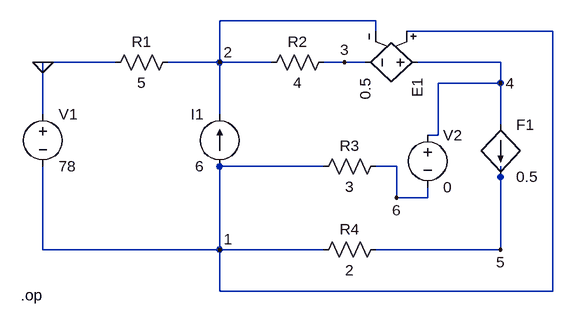
[diagram p0: schematic ex2.asc]
ex2.asc, the LTspice schematic file:
Version 4
SHEET 1 880 680
WIRE 368 16 128 16
WIRE 368 32 368 16
WIRE 640 32 416 32
WIRE -32 80 -144 80
WIRE 128 80 128 16
WIRE 128 80 48 80
WIRE 208 80 128 80
WIRE 320 80 288 80
WIRE 352 80 320 80
WIRE 560 80 432 80
WIRE 560 112 560 80
WIRE 560 112 464 112
WIRE -144 160 -144 80
WIRE 128 160 128 80
WIRE 560 176 560 112
WIRE 464 192 464 112
WIRE 464 192 448 192
WIRE 288 240 128 240
WIRE 400 240 368 240
WIRE 560 256 560 240
WIRE 400 288 400 240
WIRE 448 288 448 272
WIRE 448 288 400 288
WIRE -144 368 -144 240
WIRE 128 368 128 240
WIRE 128 368 -144 368
WIRE 288 368 128 368
WIRE 560 368 560 256
WIRE 560 368 368 368
WIRE 128 432 128 368
WIRE 640 432 640 32
WIRE 640 432 128 432
FLAG 128 368 1
FLAG -144 80 0
FLAG 128 80 2
FLAG 320 80 3
FLAG 560 112 4
FLAG 560 368 5
FLAG 400 288 6
SYMBOL res 64 64 R90
WINDOW 0 0 56 VBottom 2
WINDOW 3 32 56 VTop 2
SYMATTR InstName R1
SYMATTR Value 5
SYMBOL res 304 64 R90
WINDOW 0 0 56 VBottom 2
WINDOW 3 32 56 VTop 2
SYMATTR InstName R2
SYMATTR Value 4
SYMBOL res 384 224 R90
WINDOW 0 0 56 VBottom 2
WINDOW 3 32 56 VTop 2
SYMATTR InstName R3
SYMATTR Value 3
SYMBOL res 384 352 R90
WINDOW 0 0 56 VBottom 2
WINDOW 3 32 56 VTop 2
SYMATTR InstName R4
SYMATTR Value 2
SYMBOL voltage -144 144 R0
WINDOW 123 0 0 Left 0
WINDOW 39 0 0 Left 0
SYMATTR InstName V1
SYMATTR Value 78
SYMBOL current 128 240 R180
WINDOW 0 24 80 Left 2
WINDOW 3 24 0 Left 2
WINDOW 123 0 0 Left 0
WINDOW 39 0 0 Left 0
SYMATTR InstName I1
SYMATTR Value 6
SYMBOL e 448 80 R90
SYMATTR InstName E1
SYMATTR Value 0.5
SYMBOL voltage 448 176 R0
WINDOW 123 0 0 Left 0
WINDOW 39 0 0 Left 0
SYMATTR InstName V2
SYMATTR Value 0
SYMBOL f 560 176 R0
SYMATTR InstName F1
SYMATTR Value 0.5
SYMATTR SpiceModel v2
TEXT -178 438 Left 2 !.op

The netlist it stands for:
* ex2.asc
R1 2 0 5
R2 3 2 4
R3 6 1 3
R4 5 1 2
V1 0 1 78
I1 1 2 6
E1 4 3 1 2 0.5
V2 4 6 0
F1 4 5 v2 0.5
.op
.backanno
.end

* Results of the author's LTspice run, read from the files saved beside the schematic
* Operating Point:
*   V(2) = -1.765 V
*   V(3) = -27.18 V
*   V(6) = -65.29 V
*   V(1) = -78 V
*   V(5) = -73.76 V
*   V(4) = -65.29 V
*   I(F1) = 2.118 A
*   I(I1) = 6 A
*   I(R4) = 2.118 A
*   I(R3) = 4.235 A
*   I(R2) = -6.353 A
*   I(R1) = -352.9 mA
*   I(E1) = -6.353 A
*   I(V2) = 4.235 A
*   I(V1) = -352.9 mA